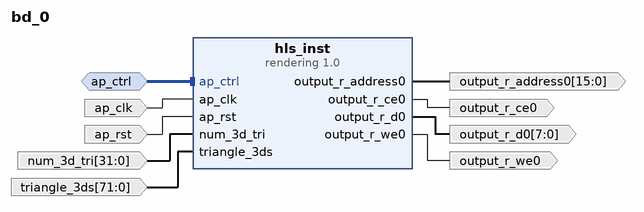
[diagram p0: block diagram of the top level]
# Vivado block design bd_0, xc7z020clg400-1, Vivado 2023.2
create_bd_design bd_0

create_bd_intf_port -mode Slave -vlnv xilinx.com:interface:acc_handshake_rtl:1.0 ap_ctrl
create_bd_port -dir I -type clk ap_clk
set_property -dict {CONFIG.FREQ_HZ 200000000.0} [get_bd_ports ap_clk]
create_bd_port -dir I -type rst ap_rst
set_property -dict {CONFIG.POLARITY ACTIVE_HIGH} [get_bd_ports ap_rst]
create_bd_port -dir I -from 31 -to 0 -type data num_3d_tri
create_bd_port -dir O -from 15 -to 0 -type data output_r_address0
create_bd_port -dir O output_r_ce0
create_bd_port -dir O -from 7 -to 0 -type data output_r_d0
create_bd_port -dir O output_r_we0
create_bd_port -dir I -from 71 -to 0 -type data triangle_3ds

create_bd_cell -type ip -vlnv xilinx.com:hls:rendering:1.0 hls_inst

# ---- connections ----

connect_bd_intf_net -intf_net ap_ctrl_0_1 [get_bd_intf_ports ap_ctrl] [get_bd_intf_pins hls_inst/ap_ctrl]
connect_bd_net -net ap_clk_0_1 [get_bd_ports ap_clk] [get_bd_pins hls_inst/ap_clk]
connect_bd_net -net ap_rst_0_1 [get_bd_ports ap_rst] [get_bd_pins hls_inst/ap_rst]
connect_bd_net [get_bd_pins hls_inst/output_r_address0] [get_bd_ports output_r_address0]
connect_bd_net [get_bd_pins hls_inst/output_r_ce0] [get_bd_ports output_r_ce0]
connect_bd_net [get_bd_pins hls_inst/output_r_d0] [get_bd_ports output_r_d0]
connect_bd_net [get_bd_pins hls_inst/output_r_we0] [get_bd_ports output_r_we0]
connect_bd_net -net num_3d_tri_0_1 [get_bd_ports num_3d_tri] [get_bd_pins hls_inst/num_3d_tri]
connect_bd_net -net triangle_3ds_0_1 [get_bd_ports triangle_3ds] [get_bd_pins hls_inst/triangle_3ds]

validate_bd_design
save_bd_design
